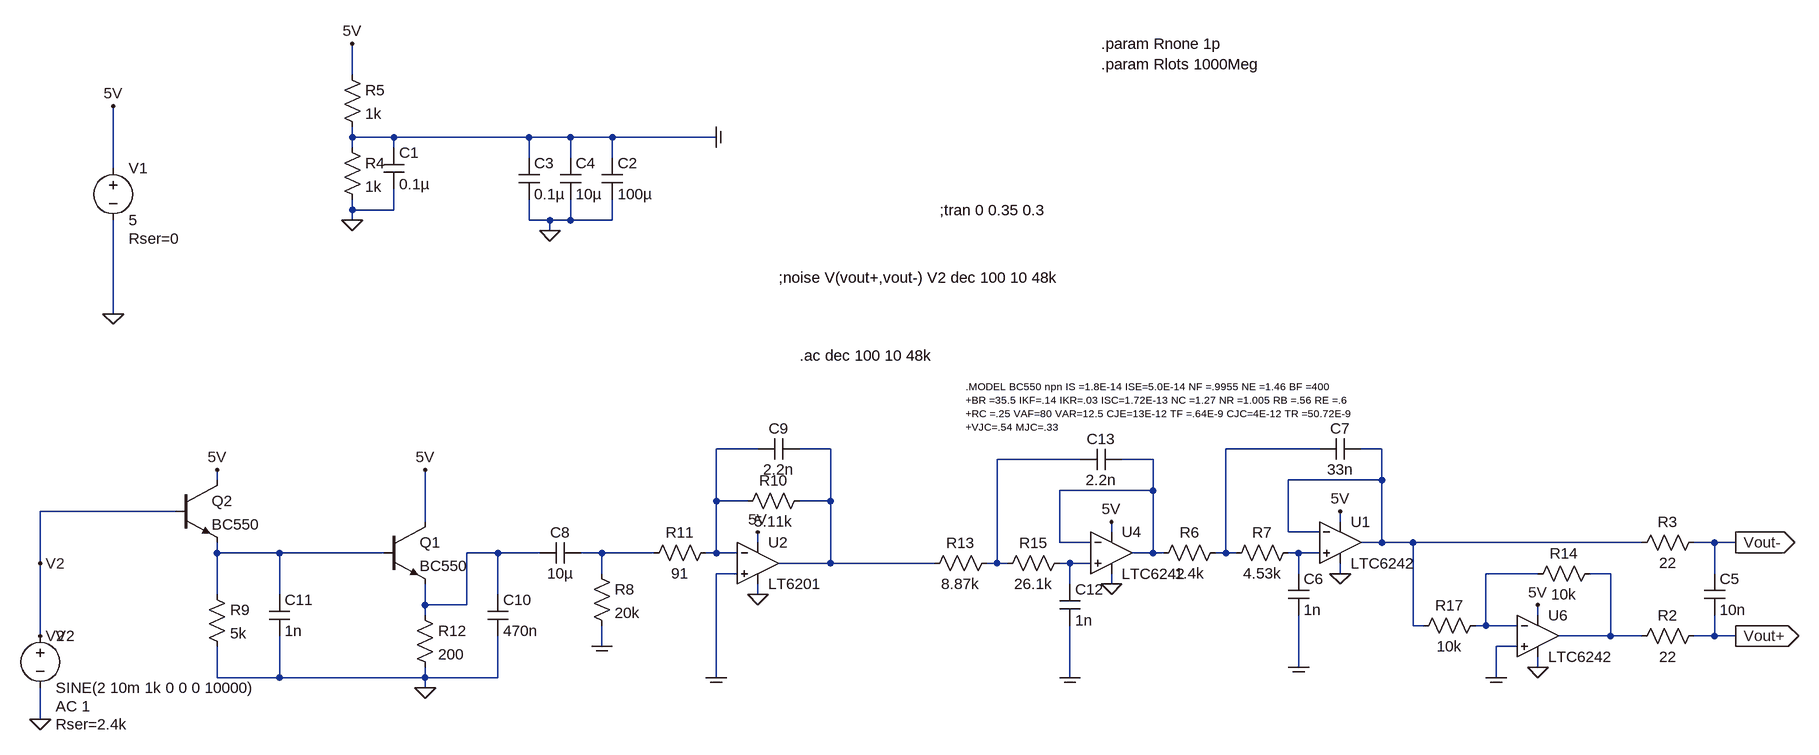
[diagram p0: schematic preamptest.asc]
preamptest.asc, the LTspice schematic file:
Version 4
SHEET 1 2944 1584
WIRE -480 -368 -480 -416
WIRE -480 -272 -480 -288
WIRE -416 -272 -480 -272
WIRE -208 -272 -416 -272
WIRE -144 -272 -208 -272
WIRE -80 -272 -144 -272
WIRE 80 -272 -80 -272
WIRE -480 -256 -480 -272
WIRE -416 -256 -416 -272
WIRE -208 -240 -208 -272
WIRE -144 -240 -144 -272
WIRE -80 -240 -80 -272
WIRE -848 -224 -848 -320
WIRE -480 -160 -480 -176
WIRE -416 -160 -416 -192
WIRE -416 -160 -480 -160
WIRE -480 -144 -480 -160
WIRE -208 -144 -208 -176
WIRE -176 -144 -208 -144
WIRE -144 -144 -144 -176
WIRE -144 -144 -176 -144
WIRE -80 -144 -80 -176
WIRE -80 -144 -144 -144
WIRE -176 -128 -176 -144
WIRE -848 0 -848 -144
WIRE 144 208 80 208
WIRE 256 208 208 208
WIRE 1008 208 864 208
WIRE 1104 208 1072 208
WIRE 640 224 512 224
WIRE 752 224 704 224
WIRE -688 256 -688 240
WIRE 1104 256 1104 208
WIRE 1104 256 960 256
WIRE 752 272 752 224
WIRE 752 272 608 272
WIRE 80 288 80 208
WIRE 128 288 80 288
WIRE 256 288 256 208
WIRE 256 288 208 288
WIRE -752 304 -960 304
WIRE -368 320 -368 240
WIRE 1040 320 1040 304
WIRE 688 336 688 320
WIRE 960 336 960 256
WIRE 1008 336 960 336
WIRE 144 352 144 336
WIRE 608 352 608 272
WIRE 656 352 608 352
WIRE 1104 352 1104 256
WIRE 1104 352 1072 352
WIRE 1152 352 1104 352
WIRE 1504 352 1152 352
WIRE 1616 352 1584 352
WIRE 1648 352 1616 352
WIRE -688 368 -688 352
WIRE -592 368 -688 368
WIRE -432 368 -592 368
WIRE -256 368 -304 368
WIRE -192 368 -256 368
WIRE -96 368 -128 368
WIRE -16 368 -96 368
WIRE 80 368 80 288
WIRE 80 368 64 368
WIRE 112 368 80 368
WIRE 752 368 752 272
WIRE 752 368 720 368
WIRE 768 368 752 368
WIRE 864 368 864 208
WIRE 864 368 848 368
WIRE 880 368 864 368
WIRE 976 368 960 368
WIRE 1008 368 976 368
WIRE -960 384 -960 304
WIRE 256 384 256 288
WIRE 256 384 176 384
WIRE 416 384 256 384
WIRE 512 384 512 224
WIRE 512 384 496 384
WIRE 528 384 512 384
WIRE 624 384 608 384
WIRE 656 384 624 384
WIRE -96 400 -96 368
WIRE 112 400 80 400
WIRE 976 400 976 368
WIRE 1040 400 1040 384
WIRE 1344 400 1264 400
WIRE 1456 400 1424 400
WIRE 1616 400 1616 352
WIRE 624 416 624 384
WIRE 688 416 688 400
WIRE 688 416 672 416
WIRE -688 432 -688 368
WIRE -592 432 -592 368
WIRE -256 432 -256 368
WIRE 144 432 144 416
WIRE -368 448 -368 416
WIRE -304 448 -304 368
WIRE -304 448 -368 448
WIRE -368 464 -368 448
WIRE 1344 464 1344 448
WIRE 1152 480 1152 352
WIRE 1168 480 1152 480
WIRE 1264 480 1264 400
WIRE 1264 480 1248 480
WIRE 1312 480 1264 480
WIRE -960 496 -960 384
WIRE 1456 496 1456 400
WIRE 1456 496 1376 496
WIRE 1504 496 1456 496
WIRE 1616 496 1616 464
WIRE 1616 496 1584 496
WIRE 1648 496 1616 496
WIRE -96 512 -96 480
WIRE 1312 512 1280 512
WIRE 976 544 976 464
WIRE 1344 544 1344 528
WIRE -688 560 -688 512
WIRE -592 560 -592 496
WIRE -592 560 -688 560
WIRE -368 560 -368 544
WIRE -368 560 -592 560
WIRE -256 560 -256 496
WIRE -256 560 -368 560
WIRE 80 560 80 400
WIRE 624 560 624 480
WIRE 1280 560 1280 512
WIRE -368 576 -368 560
WIRE -960 624 -960 576
FLAG -960 624 0
FLAG -848 0 0
FLAG -848 -320 5V
FLAG -480 -144 0
FLAG -480 -416 5V
FLAG 80 -272 COM
FLAG -960 496 V2
FLAG -176 -128 0
FLAG 1280 560 COM
FLAG 1344 448 5V
FLAG 1344 544 0
FLAG 1648 496 Vout+
IOPIN 1648 496 Out
FLAG 1648 352 Vout-
IOPIN 1648 352 Out
FLAG -960 384 V2
FLAG -96 512 COM
FLAG 144 336 5V
FLAG 144 432 0
FLAG 80 560 COM
FLAG -368 240 5V
FLAG -368 576 0
FLAG -688 240 5V
FLAG 1040 400 0
FLAG 1040 304 5V
FLAG 976 544 COM
FLAG 688 416 0
FLAG 688 320 5V
FLAG 624 560 COM
SYMBOL voltage -848 -240 R0
WINDOW 123 0 0 Left 2
WINDOW 39 24 124 Left 2
SYMATTR SpiceLine Rser=0
SYMATTR InstName V1
SYMATTR Value 5
SYMBOL voltage -960 480 R0
WINDOW 123 24 124 Left 2
WINDOW 39 24 152 Left 2
SYMATTR Value2 AC 1
SYMATTR SpiceLine Rser=2.4k
SYMATTR InstName V2
SYMATTR Value SINE(2 10m 1k 0 0 0 10000)
SYMBOL res -496 -272 R0
SYMATTR InstName R4
SYMATTR Value 1k
SYMBOL res -496 -384 R0
SYMATTR InstName R5
SYMATTR Value 1k
SYMBOL cap -224 -240 R0
SYMATTR InstName C3
SYMATTR Value 0.1µ
SYMBOL cap -160 -240 R0
SYMATTR InstName C4
SYMATTR Value 10µ
SYMBOL res 1328 416 R270
WINDOW 0 32 56 VTop 2
WINDOW 3 0 56 VBottom 2
SYMATTR InstName R14
SYMATTR Value 10k
SYMBOL res 1152 496 R270
WINDOW 0 32 56 VTop 2
WINDOW 3 0 56 VBottom 2
SYMATTR InstName R17
SYMATTR Value 10k
SYMBOL cap -432 -256 R0
SYMATTR InstName C1
SYMATTR Value 0.1µ
SYMBOL cap -96 -240 R0
SYMATTR InstName C2
SYMATTR Value 100µ
SYMBOL res 1488 512 R270
WINDOW 0 32 56 VTop 2
WINDOW 3 0 56 VBottom 2
SYMATTR InstName R2
SYMATTR Value 22
SYMBOL res 1488 368 R270
WINDOW 0 32 56 VTop 2
WINDOW 3 0 56 VBottom 2
SYMATTR InstName R3
SYMATTR Value 22
SYMBOL cap 1600 400 R0
SYMATTR InstName C5
SYMATTR Value 10n
SYMBOL cap -192 384 R270
WINDOW 0 32 32 VTop 2
WINDOW 3 0 32 VBottom 2
SYMATTR InstName C8
SYMATTR Value 10µ
SYMBOL res -112 384 R0
SYMATTR InstName R8
SYMATTR Value 20k
SYMBOL res 112 304 R270
WINDOW 0 32 56 VTop 2
WINDOW 3 0 56 VBottom 2
SYMATTR InstName R10
SYMATTR Value 5.11k
SYMBOL res -32 384 R270
WINDOW 0 32 56 VTop 2
WINDOW 3 0 56 VBottom 2
SYMATTR InstName R11
SYMATTR Value 91
SYMBOL cap 144 224 R270
WINDOW 0 32 32 VTop 2
WINDOW 3 0 32 VBottom 2
SYMATTR InstName C9
SYMATTR Value 2.2n
SYMBOL npn -432 320 R0
SYMATTR InstName Q1
SYMATTR Value BC550
SYMBOL res -384 448 R0
SYMATTR InstName R12
SYMATTR Value 200
SYMBOL npn -752 256 R0
SYMATTR InstName Q2
SYMATTR Value BC550
SYMBOL cap -272 432 R0
SYMATTR InstName C10
SYMATTR Value 470n
SYMBOL res -704 416 R0
SYMATTR InstName R9
SYMATTR Value 5k
SYMBOL Opamps\\LT6201 144 384 R0
SYMATTR InstName U2
SYMBOL Opamps\\LTC6242 1040 352 R0
SYMATTR InstName U1
SYMBOL Opamps\\LTC6242 1344 496 R0
SYMATTR InstName U6
SYMBOL cap -608 432 R0
SYMATTR InstName C11
SYMATTR Value 1n
SYMBOL res 864 352 R90
WINDOW 0 0 56 VBottom 2
WINDOW 3 32 56 VTop 2
SYMATTR InstName R6
SYMATTR Value 1.4k
SYMBOL res 976 352 R90
WINDOW 0 0 56 VBottom 2
WINDOW 3 32 56 VTop 2
SYMATTR InstName R7
SYMATTR Value 4.53k
SYMBOL cap 960 400 R0
SYMATTR InstName C6
SYMATTR Value 1n
SYMBOL cap 1072 192 R90
WINDOW 0 0 32 VBottom 2
WINDOW 3 32 32 VTop 2
SYMATTR InstName C7
SYMATTR Value 33n
SYMBOL Opamps\\LTC6242 688 368 R0
SYMATTR InstName U4
SYMBOL res 512 368 R90
WINDOW 0 0 56 VBottom 2
WINDOW 3 32 56 VTop 2
SYMATTR InstName R13
SYMATTR Value 8.87k
SYMBOL res 624 368 R90
WINDOW 0 0 56 VBottom 2
WINDOW 3 32 56 VTop 2
SYMATTR InstName R15
SYMATTR Value 26.1k
SYMBOL cap 608 416 R0
SYMATTR InstName C12
SYMATTR Value 1n
SYMBOL cap 704 208 R90
WINDOW 0 0 32 VBottom 2
WINDOW 3 32 32 VTop 2
SYMATTR InstName C13
SYMATTR Value 2.2n
TEXT 424 -160 Left 2 !;tran 0 0.35 0.3
TEXT 176 -56 Left 2 !;noise V(vout+,vout-) V2 dec 100 10 48k
TEXT 208 64 Left 2 !.ac dec 100 10 48k
TEXT 464 112 Left 1 !.MODEL BC550 npn IS =1.8E-14 ISE=5.0E-14 NF =.9955 NE =1.46 BF =400\n+BR =35.5 IKF=.14 IKR=.03 ISC=1.72E-13 NC =1.27 NR =1.005 RB =.56 RE =.6\n+RC =.25 VAF=80 VAR=12.5 CJE=13E-12 TF =.64E-9 CJC=4E-12 TR =50.72E-9\n+VJC=.54 MJC=.33
TEXT 672 -416 Left 2 !.param Rnone 1p
TEXT 672 -384 Left 2 !.param Rlots 1000Meg

The netlist it stands for:
* preamptest.asc
V1 5V 0 5 Rser=0
V2 V2 0 SINE(2 10m 1k 0 0 0 10000) AC 1 Rser=2.4k
R4 COM 0 1k
R5 5V COM 1k
C3 COM 0 0.1µ
C4 COM 0 10µ
R14 N012 N013 10k
R17 N004 N012 10k
C1 COM 0 0.1µ
C2 COM 0 100µ
R2 N013 Vout+ 22
R3 N004 Vout- 22
C5 Vout- Vout+ 10n
C8 N008 N009 10µ
R8 N009 COM 20k
R10 N001 N002 5.11k
R11 N009 N001 91
C9 N001 N002 2.2n
Q1 5V N007 N008 0 BC550
R12 N008 0 200
Q2 5V V2 N007 0 BC550
C10 N008 0 470n
R9 N007 0 5k
* U2: LT6201 (symbol Opamps\LT6201 not available, pins judged from their places): In+=COM In-=N001 V+=5V V-=0 OUT=N002
* U1: LTC6242 (symbol Opamps\LTC6242 not available, pins judged from their places): In+=N010 In-=N004 V+=5V V-=0 OUT=N004
* U6: LTC6242 (symbol Opamps\LTC6242 not available, pins judged from their places): In+=COM In-=N012 V+=5V V-=0 OUT=N013
C11 N007 0 1n
R6 N003 N006 1.4k
R7 N010 N003 4.53k
C6 N010 COM 1n
C7 N004 N003 33n
* U4: LTC6242 (symbol Opamps\LTC6242 not available, pins judged from their places): In+=N011 In-=N006 V+=5V V-=0 OUT=N006
R13 N005 N002 8.87k
R15 N011 N005 26.1k
C12 N011 COM 1n
C13 N006 N005 2.2n
.model NPN NPN
.model PNP PNP
.lib standard.bjt
;tran 0 0.35 0.3
;noise V(vout+,vout-) V2 dec 100 10 48k
.ac dec 100 10 48k
.MODEL BC550 npn IS =1.8E-14 ISE=5.0E-14 NF =.9955 NE =1.46 BF =400
+BR =35.5 IKF=.14 IKR=.03 ISC=1.72E-13 NC =1.27 NR =1.005 RB =.56 RE =.6
+RC =.25 VAF=80 VAR=12.5 CJE=13E-12 TF =.64E-9 CJC=4E-12 TR =50.72E-9
+VJC=.54 MJC=.33
.param Rnone 1p
.param Rlots 1000Meg
.backanno
.end